# EasyEDA Pro project DA15.epro, board PCB
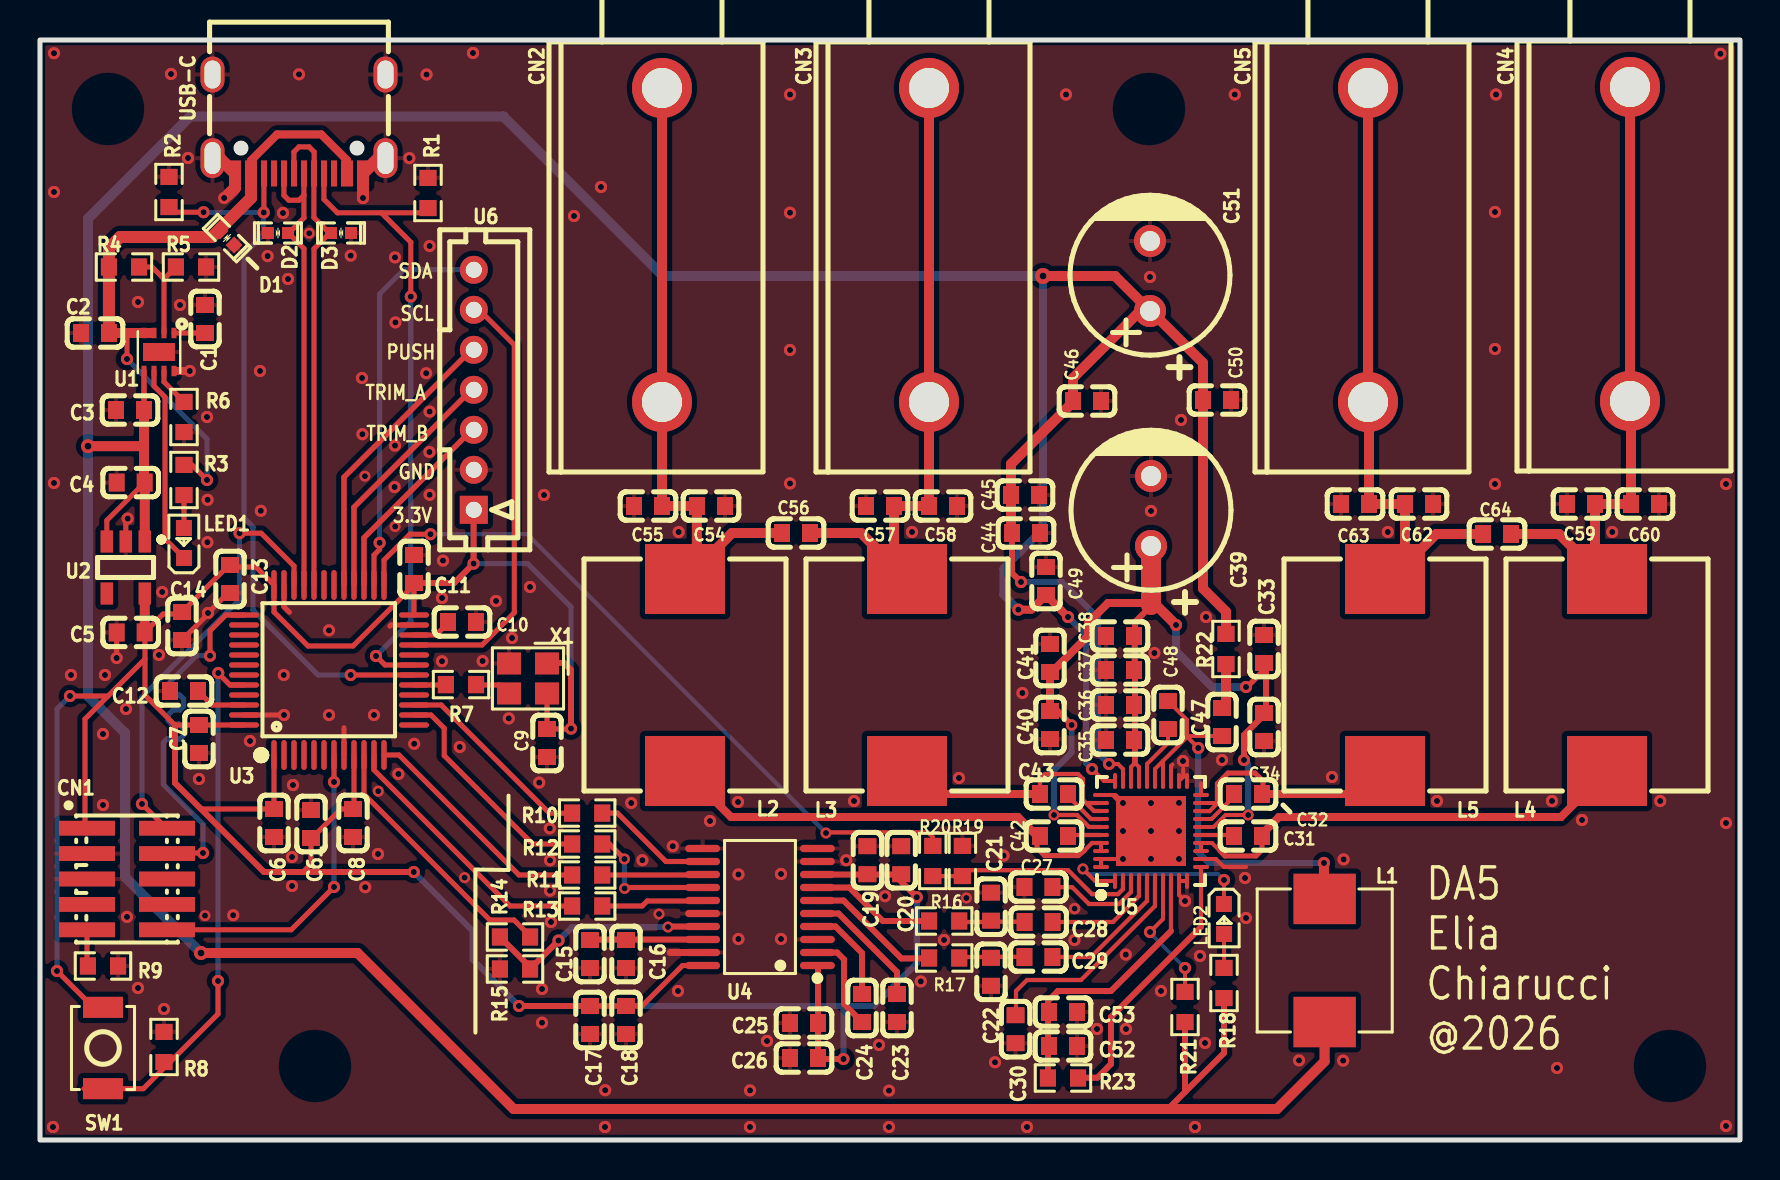
[diagram p3: board, top side]
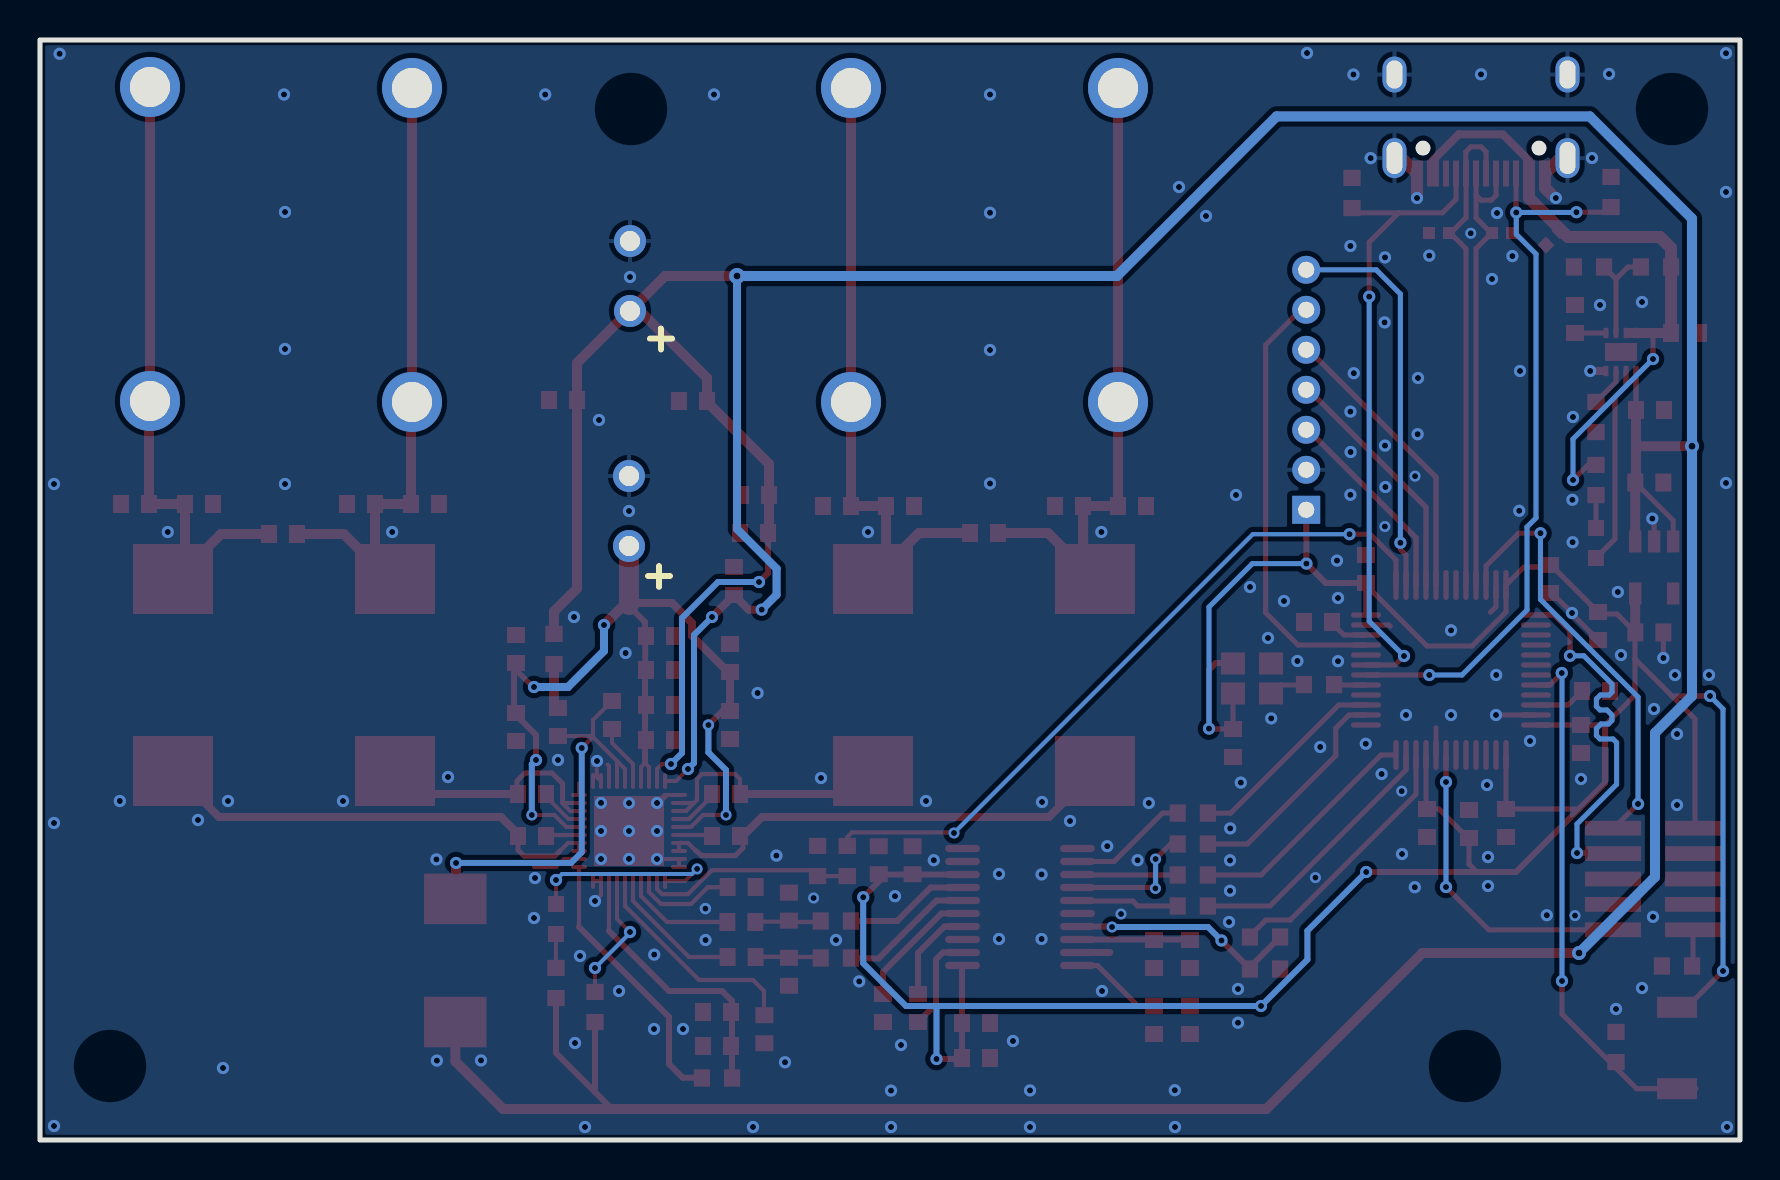
[diagram p4: board, bottom side, seen from below]

Outline 85 x 55 mm; copper layers: Top Layer, Inner1, Inner2, Bottom Layer. Coordinates in mm from the lower left corner of the outline.
Outline path: rectangle 0,0 85,55
Stack: Top Layer 0.035mm Outer layer thickness 1oz / Dielectric1 0.2104mm 7628 RC49% 8.6mil / Inner1 0.0152mm Inner layer thickness / Dielectric2 1.065mm 1.1mm H/HOZ Copper / Inner2 0.0152mm Inner layer thickness / Dielectric3 0.2104mm 7628 RC49% 8.6mil / Bottom Layer 0.035mm Outer layer thickness 1oz

## Design rules (mm)
template: Custom Config
spacing copperThickness1oz (default): track to track 0.102, other pairs 0.152 to 0.3
spacing copperThickness2oz: track to track 0.102, other pairs 0.152 to 0.3
track width copperThickness1oz (default): min 0.127, default 0.254, max 2.54
track width copperThickness2oz: min 0.203, default 0.254, max 2.54
differential pair differentialPair (default): width min 0.127, default 0.254, max 2.54; gap min 0.152, default 0.152
via viaSize (default): diameter min 0.5, default 0.61, max 10; hole min 0.3, default 0.305, max 6.3

## Placement (name value [footprint] x y rotation side)
C1  22nF  [C0603]  8.25 41.05 90 top
C2  100nF  [C0603]  2.75 40.35 0 top
C3  1uF  [C0603]  4.5 36.5 0 top
C4  1uF  [C0603]  4.53 32.87 0 top
C5  1uF  [C0603]  4.53 25.38 0 top
C6  100nF  [C0603]  11.7 15.85 90 top
C7  100nF  [C0603]  7.95 20.05 90 top
C8  100nF  [C0603]  15.65 15.85 90 top
C9  100nF  [C0603]  25.35 19.85 90 top
C10  2.2uF  [C0603]  21.1 25.9 180 top
C11  100nF  [C0603]  18.7 28.55 270 top
C12  2.2uF  [C0603]  7.2 22.45 0 top
C13  100nF  [C0603]  9.5 28.05 90 top
C14  4.7uF  [C0603]  7.1 25.7 90 top
C15  10uF  [C0603]  27.5 9.3 90 top
C16  100nF  [C0603]  29.3 9.3 90 top
C17  10uF  [C0603]  27.5 6 270 top
C18  100nF  [C0603]  29.3 6 270 top
C19  100nF  [C0603]  41.37 13.99 270 top
C20  10uF  [C0603]  43.06 13.99 270 top
C21  2.2nF  [C0603]  47.55 11.67 90 top
C22  2.2nF  [C0603]  47.55 8.41 90 top
C23  2.2uF  [C0603]  42.85 6.6 90 top
C24  2.2uF  [C0603]  41.1 6.6 90 top
C25  100nF  [C0603]  38.2 5.85 0 top
C26  10uF  [C0603]  38.2 4.1 0 top
C27  1uF  [C0603]  49.92 12.65 180 top
C28  1uF  [C0603]  49.93 10.9 180 top
C29  1uF  [C0603]  49.92 9.15 180 top
C30  1uF  [C0603]  48.78 5.54 270 top
C31  100nF  [C0603]  60.4 15.2 0 top
C32  100nF  [C0603]  60.4 17.3 0 top
C33  1uF  [C0603]  61.2 24.55 90 top
C34  100nF  [C0603]  61.2 20.65 90 top
C35  330pF  [C0603]  54 20 0 top
C36  330pF  [C0603]  54 21.75 0 top
C37  33nF  [C0603]  54 23.5 0 top
C38  10uF  [C0603]  54 25.2 180 top
C39  1000uF  [CAP-TH_BD8.0-P3.50-D0.6-FD]  55.55 31.45 90 top
C40  100nF  [C0603]  50.5 20.75 90 top
C41  1uF  [C0603]  50.5 24.1 90 top
C42  100nF  [C0603]  50.7 15.2 180 top
C43  100nF  [C0603]  50.7 17.3 0 top
C44  330pF  [C0603]  49.3 30.35 180 top
C45  33nF  [C0603]  49.25 32.25 180 top
C46  1uF  [C0603]  52.35 36.95 0 top
C47  470pF  [C0603]  59.1 20.9 90 top
C48  100nF  [C0603]  56.4 21.25 90 top
C49  10uF  [C0603]  50.3 27.95 90 top
C50  22uF  [C0603]  58.85 37 180 top
C51  1000uF  [CAP-TH_BD8.0-P3.50-D0.6-FD]  55.5 43.2 90 top
C52  22uF  [C0603]  51.15 4.7 180 top
C53  100nF  [C0603]  51.15 6.4 180 top
C54  100nF  [C0603]  33.55 31.7 180 top
C55  1nF  [C0603]  30.4 31.7 0 top
C56  1uF  [C0603]  37.8 30.35 180 top
C57  100nF  [C0603]  42 31.7 0 top
C58  1nF  [C0603]  45.15 31.7 180 top
C59  100nF  [C0603]  77.05 31.8 0 top
C60  1nF  [C0603]  80.25 31.8 180 top
C61  1uF  [C0603]  13.55 15.8 270 top
C62  100nF  [C0603]  68.95 31.8 180 top
C63  1nF  [C0603]  65.75 31.8 0 top
C64  1uF  [C0603]  72.85 30.3 0 top
CN1  BH127VS-12-10-H25-L70-R  [CONN-SMD_10P-P1.27-V-M-R2-C5-LS5.8_BH127VS-12-10-H25-L70-R]  4.35 13.05 270 top
CN2  24.243.1  [CONN-TH_24.243.1_RED]  31.1 44.75 90 top
CN3  24.243.2  [CONN-TH_24.243.2]  44.45 44.75 90 top
CN4  24.243.1  [CONN-TH_24.243.1_RED]  79.5 44.8 90 top
CN5  24.243.2  [CONN-TH_24.243.2]  66.4 44.75 90 top
D1  BPESD0402-05ST  [D0402-BI]  9.35 45.1 135 top
D2  BPESD0402-05ST  [D0402-BI]  11.9 45.35 0 top
D3  BPESD0402-05ST  [D0402-BI]  15.05 45.35 180 top
L1  4.7uH  [IND-SMD_L7.3-W6.6_MHCI06030]  64.23 8.98 270 top
L2  15uH  [IND-SMD_L11.6-W10.1]  32.25 23.25 90 top
L3  15uH  [IND-SMD_L11.6-W10.1]  43.35 23.25 90 top
L4  15uH  [IND-SMD_L11.6-W10.1]  78.35 23.25 90 top
L5  15uH  [IND-SMD_L11.6-W10.1]  67.25 23.25 90 top
LED1  NCD0603R1  [LED0603-RD_RED]  7.2 29.85 90 top
LED2  NCD0603R1  [LED0603-RD_RED]  59.2 11.05 270 top
R1  5.1kΩ  [R0603]  19.4 47.35 90 top
R2  5.1kΩ  [R0603]  6.45 47.4 90 top
R3  1kΩ  [R0603]  7.2 33 90 top
R4  1MΩ  [R0603]  4.2 43.65 180 top
R5  430kΩ  [R0603]  7.55 43.65 180 top
R6  620Ω  [R0603]  7.2 36.15 90 top
R7  22Ω  [R0603]  21.05 22.77 180 top
R8  10kΩ  [R0603]  6.2 4.65 90 top
R9  100Ω  [R0603]  3.15 8.7 180 top
R10  22Ω  [R0603]  27.36 16.35 0 top
R11  22Ω  [R0603]  27.36 13.25 0 top
R12  22Ω  [R0603]  27.36 14.8 0 top
R13  22Ω  [R0603]  27.36 11.7 0 top
R14  1kΩ  [R0603]  23.75 10.15 180 top
R15  10kΩ  [R0603]  23.75 8.55 0 top
R16  470Ω  [R0603]  45.21 10.95 0 top
R17  470Ω  [R0603]  45.21 9.1 0 top
R18  1kΩ  [R0603]  59.2 7.85 270 top
R19  10kΩ  [R0603]  46.12 13.95 90 top
R20  1kΩ  [R0603]  44.64 13.95 270 top
R21  10kΩ  [R0603]  57.25 6.65 90 top
R22  100Ω  [R0603]  59.3 24.55 270 top
R23  10kΩ  [R0603]  51.15 3.1 0 top
SW1  YZA-009  [SW-SMD_YZA-009]  3.15 4.6 90 top
U1  TPS259531DSGR  [WSON-8_L2.0-W2.0-P0.50-TL-EP]  5.95 39.4 270 top
U2  AP2112K-3.3TRG1  [SOT-25-5_L2.9-W1.6-P0.95-LS2.8-BL]  4.29 28.63 180 top
U3  STM32H503CBT6  [LQFP-48_L7.0-W7.0-P0.50-LS9.0-BL]  14.45 23.5 0 top
U4  PCM5102APWR  [TSSOP-20_L6.5-W4.4-P0.65-LS6.4-BL]  36 11.65 90 top
U5  PAM8965ZLA40-13  [WQFN-40_L5.0-W5.0-P0.40-TL-EP3.5]  55.55 15.45 90 top
U6  B7B-PH-K-S(LF)(SN)  [CONN-TH_B7B-PH-K-S-LF-SN]  21.69 37.51 270 top
USB-C  TYPE-C-31-M-12  [USB-C_SMD-TYPE-C-31-M-12_1]  12.95 50.8 180 top
X1  24.576MHz  [OSC-SMD_4P-L2.5-W2.0-BL]  24.4 23.08 180 top

## Footprints (pads in the part's own frame, mm; a bottom-side part is the same pattern mirrored in y, then rotated)
C0603
  rect 0.8x0.9 smd: 1(-0.7,0) 2(0.7,0)
CAP-TH_BD8.0-P3.50-D0.6-FD
  round 1.6 hole 1: 1(-1.75,0) 2(1.75,0)
CONN-SMD_10P-P1.27-V-M-R2-C5-LS5.8_BH127VS-12-10-H25-L70-R
  rect 0.74x2.8 smd: 1(-2.54,-2) 2(-2.54,2) 3(-1.27,-2) 4(-1.27,2) 5(0,-2) 6(0,2) 7(1.27,-2) 8(1.27,2) 9(2.54,-2) 10(2.54,2)
CONN-TH_24.243.1_RED
  round 3 hole 2: 1(-7.85,0) 2(7.85,0)
CONN-TH_24.243.2
  round 3 hole 2: 1(-7.85,0) 2(7.85,0)
CONN-TH_B7B-PH-K-S-LF-SN
  rect 1.4x1.4 hole 0.8: 1(6,0)
  round 1.4 hole 0.8: 2(4,0) 3(2,0) 4(0,0) 5(-2,0) 6(-4,0) 7(-6,0)
D0402-BI
  rect 0.6x0.6 smd: 1(-0.5,0) 2(0.5,0)
IND-SMD_L7.3-W6.6_MHCI06030
  rect 2.524x3.12 smd: 1(-3.078,0) 2(3.078,0)
IND-SMD_L11.6-W10.1
  rect 3.5x4 smd: 1(-4.8,0) 2(4.8,0)
LED0603-RD_RED
  rect 0.8x0.8 smd: 1(-0.749,-0.004) 2(0.749,0.004)
LQFP-48_L7.0-W7.0-P0.50-LS9.0-BL
  oval 0.27x1.5 smd: 1(-2.75,-4.25) 2(-2.25,-4.25) 3(-1.75,-4.25) 4(-1.25,-4.25) 5(-0.75,-4.25) 6(-0.25,-4.25) 7(0.25,-4.25) 8(0.75,-4.25) 9(1.25,-4.25) 10(1.75,-4.25) 11(2.25,-4.25) 12(2.75,-4.25) 25(2.75,4.25) 26(2.25,4.25) 27(1.75,4.25) 28(1.25,4.25) 29(0.75,4.25) 30(0.25,4.25) 31(-0.25,4.25) 32(-0.75,4.25) 33(-1.25,4.25) 34(-1.75,4.25) 35(-2.25,4.25) 36(-2.75,4.25)
  oval 1.5x0.27 smd: 13(4.25,-2.75) 14(4.25,-2.25) 15(4.25,-1.75) 16(4.25,-1.25) 17(4.25,-0.75) 18(4.25,-0.25) 19(4.25,0.25) 20(4.25,0.75) 21(4.25,1.25) 22(4.25,1.75) 23(4.25,2.25) 24(4.25,2.75) 37(-4.25,2.75) 38(-4.25,2.25) 39(-4.25,1.75) 40(-4.25,1.25) 41(-4.25,0.75) 42(-4.25,0.25) 43(-4.25,-0.25) 44(-4.25,-0.75) 45(-4.25,-1.25) 46(-4.25,-1.75) 47(-4.25,-2.25) 48(-4.25,-2.75)
OSC-SMD_4P-L2.5-W2.0-BL
  rect 1.2x1.1 smd: 1(-0.95,-0.75) 2(0.95,-0.75) 3(0.95,0.75) 4(-0.95,0.75)
R0603
  rect 0.806x0.864 smd: 1(-0.753,0) 2(0.753,0)
SOT-25-5_L2.9-W1.6-P0.95-LS2.8-BL
  rect 0.623x1.105 smd: 1(-0.95,-1.3) 2(-0.001,-1.3) 3(0.95,-1.3) 4(0.95,1.3) 5(-0.95,1.3)
SW-SMD_YZA-009
  rect 1.05x2 smd: 1(-2.035,0) 2(2.035,0)
TSSOP-20_L6.5-W4.4-P0.65-LS6.4-BL
  oval 0.364x1.742 smd: 1(-2.925,-2.871) 2(-2.275,-2.871) 3(-1.625,-2.871) 4(-0.975,-2.871) 5(-0.325,-2.871) 6(0.325,-2.871) 7(0.975,-2.871) 8(1.625,-2.871) 9(2.275,-2.871) 10(2.925,-2.871) 11(2.925,2.871) 12(2.275,2.871) 13(1.625,2.871) 14(0.975,2.871) 15(0.325,2.871) 16(-0.325,2.871) 17(-0.975,2.871) 18(-1.625,2.871) 19(-2.275,2.871) 20(-2.925,2.871)
USB-C_SMD-TYPE-C-31-M-12_1
  oval 1.2x2 hole 0.8x1.6: 1(4.325,1.706) 4(-4.325,1.706)
  oval 1.2x1.8 hole 0.8x1.4: 2(4.325,-2.474) 3(-4.325,-2.474)
  custom 0.6x1.3 smd: A1B12(-3.2,2.474) A4B9(-2.4,2.474) B1A12(3.2,2.474) B4A9(2.401,2.474)
  rect 0.3x1.3 smd: A5(-1.25,2.474) A6(-0.25,2.474) A7(0.25,2.474) A8(1.25,2.474) B5(1.75,2.474) B6(0.75,2.474) B7(-0.75,2.474) B8(-1.75,2.474)
WQFN-40_L5.0-W5.0-P0.40-TL-EP3.5
  oval 0.8x0.2 smd: 1(-2.5,1.8) 2(-2.5,1.4) 3(-2.5,1) 4(-2.5,0.6) 5(-2.5,0.2) 6(-2.5,-0.2) 7(-2.5,-0.6) 8(-2.5,-1) 9(-2.5,-1.4) 10(-2.5,-1.8) 21(2.5,-1.8) 22(2.5,-1.4) 23(2.5,-1) 24(2.5,-0.6) 25(2.5,-0.2) 26(2.5,0.2) 27(2.5,0.6) 28(2.5,1) 29(2.5,1.4) 30(2.5,1.8)
  oval 0.2x0.8 smd: 11(-1.8,-2.5) 12(-1.399,-2.5) 13(-1.001,-2.5) 14(-0.6,-2.5) 15(-0.201,-2.5) 16(0.201,-2.5) 17(0.6,-2.5) 18(1,-2.5) 19(1.399,-2.5) 20(1.8,-2.5) 31(1.8,2.5) 32(1.399,2.5) 33(1,2.5) 34(0.6,2.5) 35(0.201,2.5) 36(-0.201,2.5) 37(-0.6,2.5) 38(-1.001,2.5) 39(-1.399,2.5) 40(-1.8,2.5)
  rect 3.5x3.5 smd: 41(0,0)
WSON-8_L2.0-W2.0-P0.50-TL-EP
  rect 0.521x0.25 smd: 1(-0.95,0.75) 2(-0.95,0.25) 3(-0.95,-0.25) 4(-0.95,-0.75) 5(0.95,-0.75) 6(0.95,-0.25) 7(0.95,0.25) 8(0.95,0.75)
  rect 0.9x1.6 smd: 9(0,0)

## Nets
As in the schematic.

Pads without a net: CN1 6 7 8; U2 4; U3 2 3 4 5 6 13 16 20 30 31 38 39 40 41 42 43 45; USB-C A8 B8

## Via types
v1: diameter 0.61, hole 0.305, Top Layer to Bottom Layer, 203 vias
v2: diameter 0.55, hole 0.3, Top Layer to Bottom Layer, 15 vias
v3: diameter 0.57, hole 0.3, Top Layer to Bottom Layer, 2 vias
v4: diameter 0.8, hole 0.35, Top Layer to Bottom Layer, 1 via
v5: diameter 0.7, hole 0.35, Top Layer to Bottom Layer, 2 vias

## Routing (per net, layer and track width the routed paths; a pad name or vN(x,y) marks a point on that pad's centre or on a via; arc(x,y) is an arc through that point)
3.3V: length 172.4
  Top Layer w0.254: 2.25,15.59 2.25,21.05 3.4,22.2 ; U3.9 15.7,16.6 C8.2 15.05,16.55 13.6,15.1 C61.2 13.55,13.8 13.15,13.4 ; 8.05,16.55 C6.2 U3.1 ; SW1.2 2.67,6.63 v1(0.85,8.45) ; 3.4,22.2 5.25,24.05 ; 3.4,22.2 v1(1.5,22.2) ; X1.4 C9.2 26.53,20.55 v1(26.55,20.57) ; 33.13,8.72 32.12,8.72 30.1,6.7 C18.1 C17.1 ; 5.25,24.05 5.25,22.24 6.75,20.74 6.76,20.75 C7.2 U3.48 ; 5.25,24.05 5.25,25.35 ; 5.24,25.39 6.15,26.3 7.35,26.3 7.35,26.65 9.35,28.65 10.8,28.65 U3.36 11.7,26.4 13.4,24.7 15.65,24.7 18.7,27.75 U3.24
  Top Layer w0.3: v1(23.95,6.7) C17.1 ; U6.1 21.68,31.5 v1(21.68,28.82) 20.71,27.85 C11.2 ; v1(40.17,4.05) 38.9,4.05 C25.2 38.9,8.7 38.87,8.72 ; 6.75,20.74 6.75,17.85 11.2,13.4 v1(18.69,13.4) ; U4.8 42.71,13.28 v1(43.84,12.14) ; v1(26.55,20.57) 26.55,23.51 26.21,23.85 24.95,23.85
  Top Layer w0.5: 5.24,25.39 U2.5
  Bottom Layer w0.254: v1(1.5,22.2) 0.85,21.55 v1(0.85,8.45) ; v1(21.68,28.82) 24.38,28.82 26.55,26.65 v1(26.55,20.57)
  Bottom Layer w0.3: v1(43.84,12.14) 43.84,8.84 41.7,6.7 40.17,6.7 ; 40.17,6.7 v1(23.95,6.7) 21.63,9.02 21.63,10.46 v1(18.69,13.4) ; 40.17,6.7 v1(40.17,4.05)
5V: length 264.5
  Top Layer w0.2: v1(53.45,18.8) 53.9,18.8 54.15,18.55 U5.29 ; v1(52.6,18.55) 53.2,17.95 U5.30
  Top Layer w0.25: C4.2 3.34,30.98 3.34,29.92
  Top Layer w0.27: U1.5 C3.2
  Top Layer w0.3: C44.2 48.6,28.35 v1(49.05,27.9) ; 57.25,2.4 59.2,4.35 R18.2 ; 57.25,2.4 57.25,5.85 57.3,5.9 ; 57.25,2.4 56.55,1.7
  Top Layer w0.4: v1(51.4,26.15) C49.1 49.57,26.52 v1(48.92,26.52)
  Top Layer w0.5: C51.1 53.75,43.2 v4(50.15,43.2) ; C44.2 48.55,30.4 C45.2 48.55,33.8 51.65,36.9 51.65,38.1 54.9,41.35 55.65,41.35 58.15,38.85 C50.2 58.15,27.57 59.3,26.42 59.3,25.25 ; 5.15,32.95 C4.2 ; L1.2 64.23,5.89 64.23,3.93 61.85,1.55 23.68,1.55 15.88,9.35 v5(8.05,9.35) ; 5.2,34.69 5.2,32.95 ; 5.2,34.69 v5(2.4,34.69) ; 5.2,34.69 C3.2 ; 5.24,32.87 5.24,29.92
  Bottom Layer w0.3: v1(53.45,18.8) 52.9,19.35 52.9,26.1 51.1,27.9 v1(49.05,27.9) ; v1(51.4,26.15) 52.3,25.25 52.3,18.85 v1(52.6,18.55)
  Bottom Layer w0.4: v1(48.92,26.52) 48.17,27.26 48.17,28.57 50.15,30.55 v4(50.15,43.2)
  Bottom Layer w0.5: v5(8.05,9.35) 4.25,13.15 4.25,20.35 2.4,22.2 v5(2.4,34.69) 2.4,46.07 7.51,51.18 23.17,51.18 31.15,43.2 v4(50.15,43.2)
GND: length 28.6
  Top Layer w0.2: 60.3,13.65 59.2,13.65 58.8,14.05 U5.12 ; v1(57.25,11.95) 56.95,12.25 U5.9 U5.10 ; U5.20 58.05,17.84 ; U5.22 57.16,18.16 57.16,18.56 ; U5.23 56.55,18.7 56.62,18.77 ; v1(54.15,14.05) U5.39 U5.40 ; 57.35,18.75 v1(57.15,18.95) ; U5.31 53.75,17.25
  Top Layer w0.25: 17.49,25.69 17.55,25.75 U3.23 ; U3.8 15.2,20.61
  Top Layer w0.254: U3.35 12.2,26.66 12.47,26.39 ; v1(4.38,31.07) 4.29,30.98 4.29,29.92 ; U3.47 v1(12.2,21.25) ; C5.1 v1(3.83,24.1) ; C14.1 8.4,26.3 v1(8.4,26.35) 9.3,27.25 9.45,27.25
  Top Layer w0.3: 53.75,17.2 54.15,16.8
  Top Layer w0.35: U4.19 31.51,9.38
  Top Layer w0.4: 6.8,38.45 v1(7.49,38.45)
  Top Layer w0.6: 9.4,47.25 9.75,47.6 9.75,48.28 ; USB-C.4 16.92,49.09 USB-C.A1B12 v1(16.15,47.1) ; USB-C.B1A12 8.98,49.09 USB-C.1
  vias: v1(0.7,54.34) v1(0.7,47.4) v1(0.7,32.85) v1(0.65,0.65) v1(1.55,23.25) v1(3.25,23.25) v1(3.15,20.3) v1(3.15,16.75) v1(4.3,21.55) v1(4.35,11.16) v1(4.9,41.9) v1(4.9,7.6) v1(5.95,24.25) v1(6.11,27.4) v1(6.2,6.55) v1(6.55,53.3) v1(7,41.75) v1(7.4,49.1) v1(7.95,18.05) v1(8.35,36.15) v1(8.38,32.01) v1(8.37,29.89) v1(9.21,47.1) v1(9.66,11.24) v1(10.5,19.95) v1(11,38.45) v1(11.04,31.46) v1(11.38,44.2) v1(12.15,46.35) v1(12.19,23.25) v1(12.4,43.05) v1(12.6,14.15) v1(12.6,12.7) v1(12.65,17.75) v1(12.95,53.28) v1(14.45,25.48) v1(14.45,21.25) v1(15.54,44.22) v1(16.1,38.1) v1(16.12,35.29) v1(16.26,12.64) v1(16.7,21.25) v1(16.9,14.3) v1(17.73,32.65) v1(17.75,44.13) v1(17.77,40.88) v1(17.75,34.72) v1(17.92,18.3) v1(18.47,49.09) v1(18.71,19.81) v1(19.33,53.27) v1(19.31,38.34) v1(19.48,44.7) v1(19.48,36.42) v1(19.47,34.4) v1(19.48,32.26) v1(20.1,27.1) v1(20.1,23.94) v1(20.15,28.97) v1(20.99,19.65) v1(21.65,54.35) v1(22.13,23.95) v1(22.8,26.95) v1(23.44,21.08) v1(23.6,25.1) v1(24.5,27.65) v1(24.96,17.87) v1(25.1,7.55) v1(25.1,5.86) v1(25.2,32.25) v1(25.49,15.58) v1(25.5,13.98) v1(25.5,12.46) v1(25.55,10.9) v1(26.7,46.2) v1(28.05,47.65) v1(28.25,0.65) v1(28.26,2.49) v1(29.56,16.85) v1(30.12,13.99) v1(31.64,14.69) v1(31.93,30.4) v1(31.9,7.45) v1(33.5,15.95) v1(34.9,16.9) v1(34.92,13.28) v1(34.92,10.05) v1(35.5,2.48) v1(35.5,0.65) v1(36.35,4.95) v1(37.05,13.3) v1(37.05,10.05) v1(37.5,52.28) v1(37.5,46.36) v1(37.5,39.5) v1(37.5,32.83) v1(40.31,13.99) v1(40.7,16.95) v1(41.95,4.75) v1(42.25,12.19) v1(42.45,2.47) v1(42.45,0.65) v1(43.6,30.4) v1(44.04,7.93) v1(45.2,10) v1(45.95,18.1) v1(47.75,3.89) v1(48.18,14.22) v1(49.12,22.35) v1(49.35,0.65) v1(51.3,52.28) v1(51.72,10) v1(52.85,5.55) v1(54.15,16.85) v1(54.15,15.45) v1(54.29,9.27) v1(54.3,5.55) v1(55.5,43.15) v1(55.55,31.45) v1(55.55,16.85) v1(55.55,15.45) v1(55.55,14.06) v1(55.72,24.35) v1(56.05,7.45) v1(56.95,16.86) v1(56.95,15.45) v1(56.95,14.05) v1(57.05,36) v1(57.75,0.65) v1(58,9.2) v1(58.25,4.85) v1(58.3,26.15) v1(59.1,19) v1(59.74,52.28) v1(60.25,13.1) v1(60.3,11.1) v1(62.95,3.98) v1(64.6,18.15) v1(65.18,14.03) v1(65.16,3.97) v1(67.39,30.4) v1(69.85,16.95) v1(72.8,52.28) v1(72.75,46.4) v1(72.75,39.55) v1(72.75,32.8) v1(75.6,16.95) v1(75.85,3.6) v1(77.1,16) v1(78.61,30.4) v1(81.01,16.95) v1(84.02,54.31) v1(84.3,32.8) v1(84.3,15.85) v1(84.3,0.7) v2(8.25,11.22) v2(13.46,45.34) v2(16.25,33.19) v2(16.91,17.44) v2(17.76,30.67) v2(21.23,13.12) v2(30.95,11.3) v2(46.32,12.1) v3(51.73,11.57)
PVDD: length 49.8
  Top Layer w0.2: v2(60.41,16.25) 59.28,16.25 58.68,15.65 U5.16 ; U5.28 54.55,18.65 54.75,18.85 54.95,18.65 U5.27
  Top Layer w0.21: v2(50.7,16.25) 51.85,16.25 52.45,15.65 U5.35
  Top Layer w0.27: v1(60.3,22.65) 60.35,22.65 61.3,23.6 ; 61.35,23.95 61.35,23.8 ; 61.3,23.72 61.34,23.79
  Top Layer w0.3: 55.41,26.56 54.75,25.9 54.75,25.25 C38.1 54.74,25.16 54.74,23.54 C37.2 54.75,23.45 54.75,18.85 ; C40.2 50.88,21.45 v3(51.58,20.75) ; 61.3,23.72 61.3,21.35 60.2,20.25 v1(60.2,19) ; 61.3,23.75 61.34,23.79 61.35,23.8
  Top Layer w0.4: 55.45,26.85 53.4,26.85 52.4,25.85 52.4,25.2 50.6,23.4 C41.1 C40.2
  Top Layer w0.5: v1(56.8,25.75) 55.77,26.78
  Top Layer w1: C39.1 55.55,26.75
  Bottom Layer w0.3: v2(50.7,16.25) 50.7,18.5 51.58,19.38 v3(51.58,20.75) ; v2(60.41,16.25) 60.41,18.79 v1(60.2,19)
  Bottom Layer w0.4: v1(56.8,25.75) 56.8,24.45 58.6,22.65 v1(60.3,22.65)
VBUS: length 33.3
  Top Layer w0.25: 4.35,40.35 v1(4.35,39.05)
  Top Layer w0.254: v1(8.35,33) 7.6,33.75 R3.2
  Top Layer w0.35: 15.35,48.38 15.35,48.99
  Top Layer w0.4: 15.35,48.99 15.35,49 14.06,50.28 11.86,50.28 10.55,48.97 10.55,48.38
  Top Layer w0.5: C2.2 U1.4 5.55,40.35
  Top Layer w0.6: C2.2 3.45,40.35 R4.2 3.45,44.6 4,45.15 8.6,45.15 10.55,47.1 10.55,48.38
  Bottom Layer w0.254: v1(4.35,39.05) 8.35,35.05 v1(8.35,33)
VDD: length 14
  Top Layer w0.21: U5.8 56.55,10.45
  Top Layer w0.3: 50.4,3.05 50.4,3.05 50.4,6.95 50.9,7.45 53.55,7.45 56.55,10.45
AMP_EN: length 35.9
  Top Layer w0.21: v2(39.3,15.35) 39.33,15.38 44.4,15.38 44.64,15.14 44.64,14.75
  Top Layer w0.254: U3.25 17.2,28.99 18.5,30.29 v1(19.52,30.29)
  Bottom Layer w0.21: v1(19.52,30.29) 24.36,30.29 v2(39.3,15.35)
CC1: length 32.4
  Top Layer w0.254: 14.2,48.23 14.2,47.04 14.88,46.36 17.07,46.36 ; 17.07,46.36 19.14,46.36 19.41,46.63 ; 17.07,46.36 18.54,44.89 v1(18.54,42.17) ; v1(16.8,24.2) 17.25,23.75 U3.19
  Bottom Layer w0.254: v1(18.54,42.17) 18.54,25.94 v1(16.8,24.2)
CC2: length 36.7
  Top Layer w0.254: U3.18 v1(15.54,23.25) ; v1(11.19,46.38) 11.2,46.39 11.2,48.33 ; v1(8.18,46.39) 6.71,46.39 R2.1
  Bottom Layer w0.254: v1(8.18,46.39) 8.19,46.38 v1(11.19,46.38) 11.19,45.29 10.2,44.3 10.2,31.1 10.65,30.65 10.65,26.5 13.9,23.25 v1(15.54,23.25)
D_OUTL: length 3.3
  Top Layer w0.21: C29.2 49.21,9.16 47.55,9.16 ; 47.45,9.06 47.37,9.15 45.96,9.15
  Top Layer w0.254: 47.45,9.06 47.55,9.16
D_OUTR: length 3.3
  Top Layer w0.21: C28.2 49.21,10.92 47.55,10.92 ; 45.96,10.9 47.54,10.9
  Top Layer w0.254: 47.54,10.9 47.55,10.92
DN: length 24.6
  Top Layer w0.254: 13.7,27.75 13.7,44.56 14.48,45.34 13.7,46.12 13.7,48.33 13.71,48.34 13.71,49.4 13.45,49.66 12.95,49.66 12.7,49.41 12.7,48.33
DP: length 23.5
  Top Layer w0.254: 13.2,47.24 12.95,46.99 12.44,46.99 12.2,47.23 12.2,48.33 ; 13.2,47.24 13.2,48.33 ; 13.2,47.24 13.2,46.11 12.43,45.34 13.2,44.57 U3.33
I2C_SCL: length 21.4
  Top Layer w0.254: U3.21 22.1,24.75 23.72,26.37 23.72,39.75 22.1,41.37
I2C_SDA: length 19.9
  Top Layer w0.254: U3.26 16.7,29.25 16.98,29.53 v1(16.98,29.86)
  Bottom Layer w0.254: U6.7 18.19,43.51 16.98,42.3 v1(16.98,29.86)
I2S_CK: length 11.9
  Top Layer w0.254: R11.1 23.95,13.25 17.95,19.25 U3.12
I2S_MCK: length 10.1
  Top Layer w0.254: U3.15 20.06,21.75 25.47,16.34 26.6,16.34 26.61,16.35
I2S_SD: length 11.4
  Top Layer w0.254: R12.1 24.63,14.8 20.21,19.22 20.21,20.59 19.55,21.25 U3.14
I2S_WS: length 13.5
  Top Layer w0.254: U3.11 16.7,18.5 23.5,11.7 R13.1
L_OUT_N: length 11.6
  Top Layer w0.2: 58.9,16.85 U5.19 ; U5.18 58.06,16.44 58.48,16.44 58.85,16.81 58.85,16.85
  Top Layer w0.25: 58.87,16.97 58.87,17.82 59.4,18.35 60.75,18.35 61.15,17.95 61.15,17.3
  Top Layer w0.4: 66.7,17.3 61.15,17.3
L_OUT_P: length 23.1
  Top Layer w0.2: 59,14.45 58.6,14.85 U5.14 U5.13 58.05,14.45
  Top Layer w0.25: 61.1,15.15 61.1,14.5 60.8,14.2 59.25,14.2 59,14.45
  Top Layer w0.4: 61.1,15.15 61.1,15.3 61.95,16.15 76.05,16.15 78.2,18.3 78.35,18.3
MUTE: length 13.2
  Top Layer w0.254: R14.1 24.5,10.2 23.7,11 22.49,11 16.2,17.29 U3.10
PLIM: length 13.5
  Top Layer w0.21: U5.11 58.05,10.65
  Top Layer w0.3: 58.05,10.65 53.55,6.15 53.55,3.8 52.86,3.11 52.1,3.11 52.06,3.07
PUSH: length 14.5
  Top Layer w0.27: U3.29 15.2,33.14 21.57,39.51 U6.5
R_OUT_N: length 11.5
  Top Layer w0.21: U5.33 52.7,16.45 52.15,17 52.15,18.05 51.9,18.3 50.25,18.3 50,18.05 C43.1 50,17.25 ; 52.96,16.85 52.3,16.85
  Top Layer w0.4: C43.1 44.5,17.3
R_OUT_P: length 23.8
  Top Layer w0.2: U5.38 U5.37
  Top Layer w0.21: 52.22,14.47 52.6,14.85 U5.37 ; 49.85,15.15 49.97,15.28
  Top Layer w0.25: 49.85,14.6 49.85,15.15
  Top Layer w0.252: 49.85,14.6 50.23,14.22 51.91,14.22 52.22,14.47
  Top Layer w0.4: 49.97,15.28 49.78,15.28 48.9,16.15 34.55,16.15 L2.1
RST: length 15.9
  Top Layer w0.254: v1(14.7,12.65) 12.56,10.51 6.25,10.51 ; v1(14.7,17.9) U3.7
  Bottom Layer w0.254: v1(14.7,12.65) v1(14.7,17.9)
SWCLK: length 19.6
  Top Layer w0.254: 6.25,14.32 6.28,14.35 v1(8.15,14.35) ; U3.37 9.29,26.25 8.5,25.46 v1(8.5,24.21)
  Bottom Layer w0.254: v1(8.5,24.21) 7.81,24.21 6.4,22.8 6.4,22.4 6.55,22.25 6.98,22.25 7.18,22.05 7.18,21.68 7,21.5 6.65,21.5 6.4,21.25 6.4,20.98 6.58,20.8 6.95,20.8 7.18,20.57 7.18,20.23 7,20.05 6.35,20.05 6.17,19.87 6.17,17.78 8.15,15.8 v1(8.15,14.35)
SWDIO: length 21.6
  Top Layer w0.254: 6.25,15.59 6.25,15.65 v1(5.1,16.8) ; v1(9.98,30.34) 11.06,30.34 12.7,28.7 U3.34
  Bottom Layer w0.254: v1(5.1,16.8) 5.1,22.15 9.98,27.03 v1(9.98,30.34)
TRIM_A: length 12.3
  Top Layer w0.27: U6.4 21.57,37.51 15.7,31.64 U3.28
TRIM_B: length 10.1
  Top Layer w0.27: U3.27 16.2,30.11 21.6,35.51 U6.3
$1N9692: length 1.8
  Top Layer w0.254: CN1.9 2.35,8.75 2.3,8.7
$1N11114: length 26.8
  Top Layer w0.254: v1(8.91,23.35) 8.91,23.34 9.5,22.75 U3.44 ; v1(8.9,7.95) 8.9,6.3 5.17,2.56 2.2,2.56
  Bottom Layer w0.254: v1(8.91,23.35) 8.9,23.34 v1(8.9,7.95)
$1N19203: length 2.6
  Top Layer w0.254: C12.2 8.6,21.75 U3.46
$1N19255: length 2.2
  Top Layer w0.254: 20.55,26 19.8,25.25 U3.22
$1N22344: length 1.2
  Top Layer w0.254: 21.8,22.75 22.99,22.75
$1N22347: length 1.6
  Top Layer w0.254: 20.26,22.75 U3.17
$2N860: length 5
  Top Layer w0.254: R5.2 6.2,43.05 6.2,43.05 ; R4.1 5.6,43.65 6.2,43.05 ; 6.2,43.05 U1.2
$2N864: length 1.5
  Top Layer w0.254: U1.1 C1.1
$2N869: length 2
  Top Layer w0.254: R6.2 6.2,37.9 U1.7
$2N871: length 10
  Top Layer w0.254: LED1.1 6.25,30.05 6.25,37.15 5.7,37.7 U1.6
$2N874: length 1.6
  Top Layer w0.254: R3.1 7.2,30.6 7.2,30.6
$3N915: length 5
  Top Layer w0.254: U4.13 33.1,13.25 R11.2
$3N918: length 6.8
  Top Layer w0.254: v2(29.22,14.05) 28.47,14.8 R12.2 ; v2(29.23,12.58) 29.28,12.62 U4.14
  Bottom Layer w0.254: v2(29.22,14.05) 29.22,12.59 v2(29.23,12.58)
$3N921: length 5.1
  Top Layer w0.254: R13.2 30.11,11.7 30.36,11.95 32.5,11.95 32.53,11.97 U4.15
$3N930: length 11.6
  Top Layer w0.3: R14.2 24.55,8.6 v1(25.93,9.97) ; v2(31.4,10.65) 31.43,10.67 U4.17
  Bottom Layer w0.3: v1(25.93,9.97) 26.6,10.65 v2(31.4,10.65)
$3N957: length 6.3
  Top Layer w0.3: C23.2 42.85,8.4 39.93,11.33 U4.5
$3N959: length 5
  Top Layer w0.3: U4.2 39.85,9.38 40.2,9.03 40.2,6.8 C24.1
$3N963: length 4.8
  Top Layer w0.3: C24.2 41.1,9.35 39.78,10.67 U4.4
$3N970: length 6.3
  Top Layer w0.3: R16.1 42.14,10.95 40.47,12.62 U4.7
$3N973: length 6.6
  Top Layer w0.3: U4.6 40.18,11.97 43.07,9.08 44.29,9.08
$3N989: length 5.5
  Top Layer w0.3: 27.62,10.03 U4.18
$3N1715: length 31.3
  Top Layer w0.5: 32.84,28.59 34.6,30.35 C56.2 ; 32.84,28.59 32.84,31.41 ; 32.84,28.59 32.25,28 ; 31.1,52.55 C55.2 32.75,31.7 32.85,31.6
$3N1719: length 31.4
  Top Layer w0.5: 44.45,52.55 C58.2 C57.2 42.7,28.7 ; 42.7,28.7 L3.2 ; 42.7,28.7 41.05,30.35 C56.1
$3N1964: length 5.1
  Top Layer w0.21: U5.3 54.55,12.4 53.95,11.8 52.45,11.8 51.61,12.64 50.61,12.64 50.57,12.6
$3N1968: length 11.2
  Top Layer w0.21: C30.1 48.8,6.26 48.8,7.45 49.35,8 52.05,8 55.75,11.7 U5.6
$3N2047: length 5.7
  Top Layer w0.21: 50.57,10.9 53.65,10.9 54.95,12.2 U5.4
$3N2053: length 6.9
  Top Layer w0.21: U5.5 55.35,11.95 52.55,9.15 50.57,9.15
$3N2247: length 1.7
  Top Layer w0.2: R18.1 59.2,8.61 LED2.2
$3N2254: length 10.3
  Top Layer w0.2: 59.2,11.8 59.2,11.8 v1(59.2,13) ; U5.1 52.75,12.95 v2(52.15,13.55)
  Bottom Layer w0.2: v1(59.2,13) 58.9,13.3 52.4,13.3 v2(52.15,13.55)
$3N2795: length 2.1
  Top Layer w0.5: 59.3,21.6 59.3,23.75
$3N2805: length 22.4
  Top Layer w0.2: 57.38,20.18 57.38,20.13 v1(57.91,19.6) ; 57.38,20.18 57.4,20.2 59.3,20.2 ; 57.38,20.18 57.35,20.15 ; C48.2 57.35,21 57.35,20.15 ; 56.15,18.95 U5.24 ; 56.15,18.95 57.35,20.15 ; 56.15,18.95 55.75,18.55 U5.25
  Top Layer w0.5: v1(64.2,13.85) 64.2,12.06 64.23,12.02
  Bottom Layer w0.3: v1(64.2,13.85) 58.45,13.85 57.91,14.39 v1(57.91,19.6)
$3N2916: length 3
  Top Layer w0.2: U5.26 55.35,18.8 56.4,19.85 C48.1
$3N4017: length 1.7
  Top Layer w0.21: U5.15 59.6,15.25 59.7,15.15
$3N4137: length 2.2
  Top Layer w0.2: 58.1,16.05 58.58,16.05 59.75,17.22 59.75,17.3
$3N4244: length 1.6
  Top Layer w0.21: 53.05,15.25 51.4,15.25
$3N4280: length 2.2
  Top Layer w0.21: 51.4,17.25 51.4,17.2 52.55,16.05 U5.34
$3N4548: length 6.2
  Top Layer w0.2: v1(55.5,10.4) 56.15,11.05 U5.7 ; 57.25,7.75 v1(57.25,8.6)
  Bottom Layer w0.2: v1(57.25,8.6) 55.5,10.35 v1(55.5,10.4)
$3N5926: length 31.8
  Top Layer w0.5: 77.75,28.5 C59.2 C60.2 79.55,36.9 CN4.1 CN4.2 ; 77.75,28.5 78.35,27.9 ; 77.75,28.5 75.95,30.3 C64.2
$3N5932: length 31.3
  Top Layer w0.5: 68.25,28.74 C62.2 C63.2 66.45,36.85 CN5.1 CN5.2 ; 68.25,28.74 68.25,28.45 67.7,27.9 ; 68.25,28.74 69.81,30.3 C64.1
$3N8324: length 10.6
  Top Layer w0.21: U5.2 54.15,12.55 53.9,12.29 52.6,12.29 51.41,13.49 46.49,13.49 46.2,13.2 ; R19.1 R20.2
$3N33548: length 6
  Top Layer w0.254: R10.2 28.87,16.35 31.29,13.92 33.13,13.92

## Copper pours and planes (outline as drawn; the poured copper is in the pictures)
GND on Top Layer: -0.95,0 -0.95,55.45 87.9,55.45 87.9,0
GND on Bottom Layer: -0.35,0.05 -0.35,55.7 86.75,55.7 86.75,0.05
GND on Inner1: 0.26,54.74 84.74,54.74 84.74,0.26 0.26,0.26
GND on Inner2: 0.26,54.74 84.74,54.74 84.74,0.26 0.26,0.26

Small or netless copper shapes (teardrops, artwork), in the pictures only: 24 on Inner1, 24 on Inner2

## Text on the board
Top Silkscreen Layer: TRIM_A | TRIM_B | 3.3V | SCL | PUSH | SDA | GND | DA5 / Elia / Chiarucci / @2026
